# Altium schematic sheet SimonDuino.SchDoc
size A2; SheetNumber: 1; SheetTotal: 1
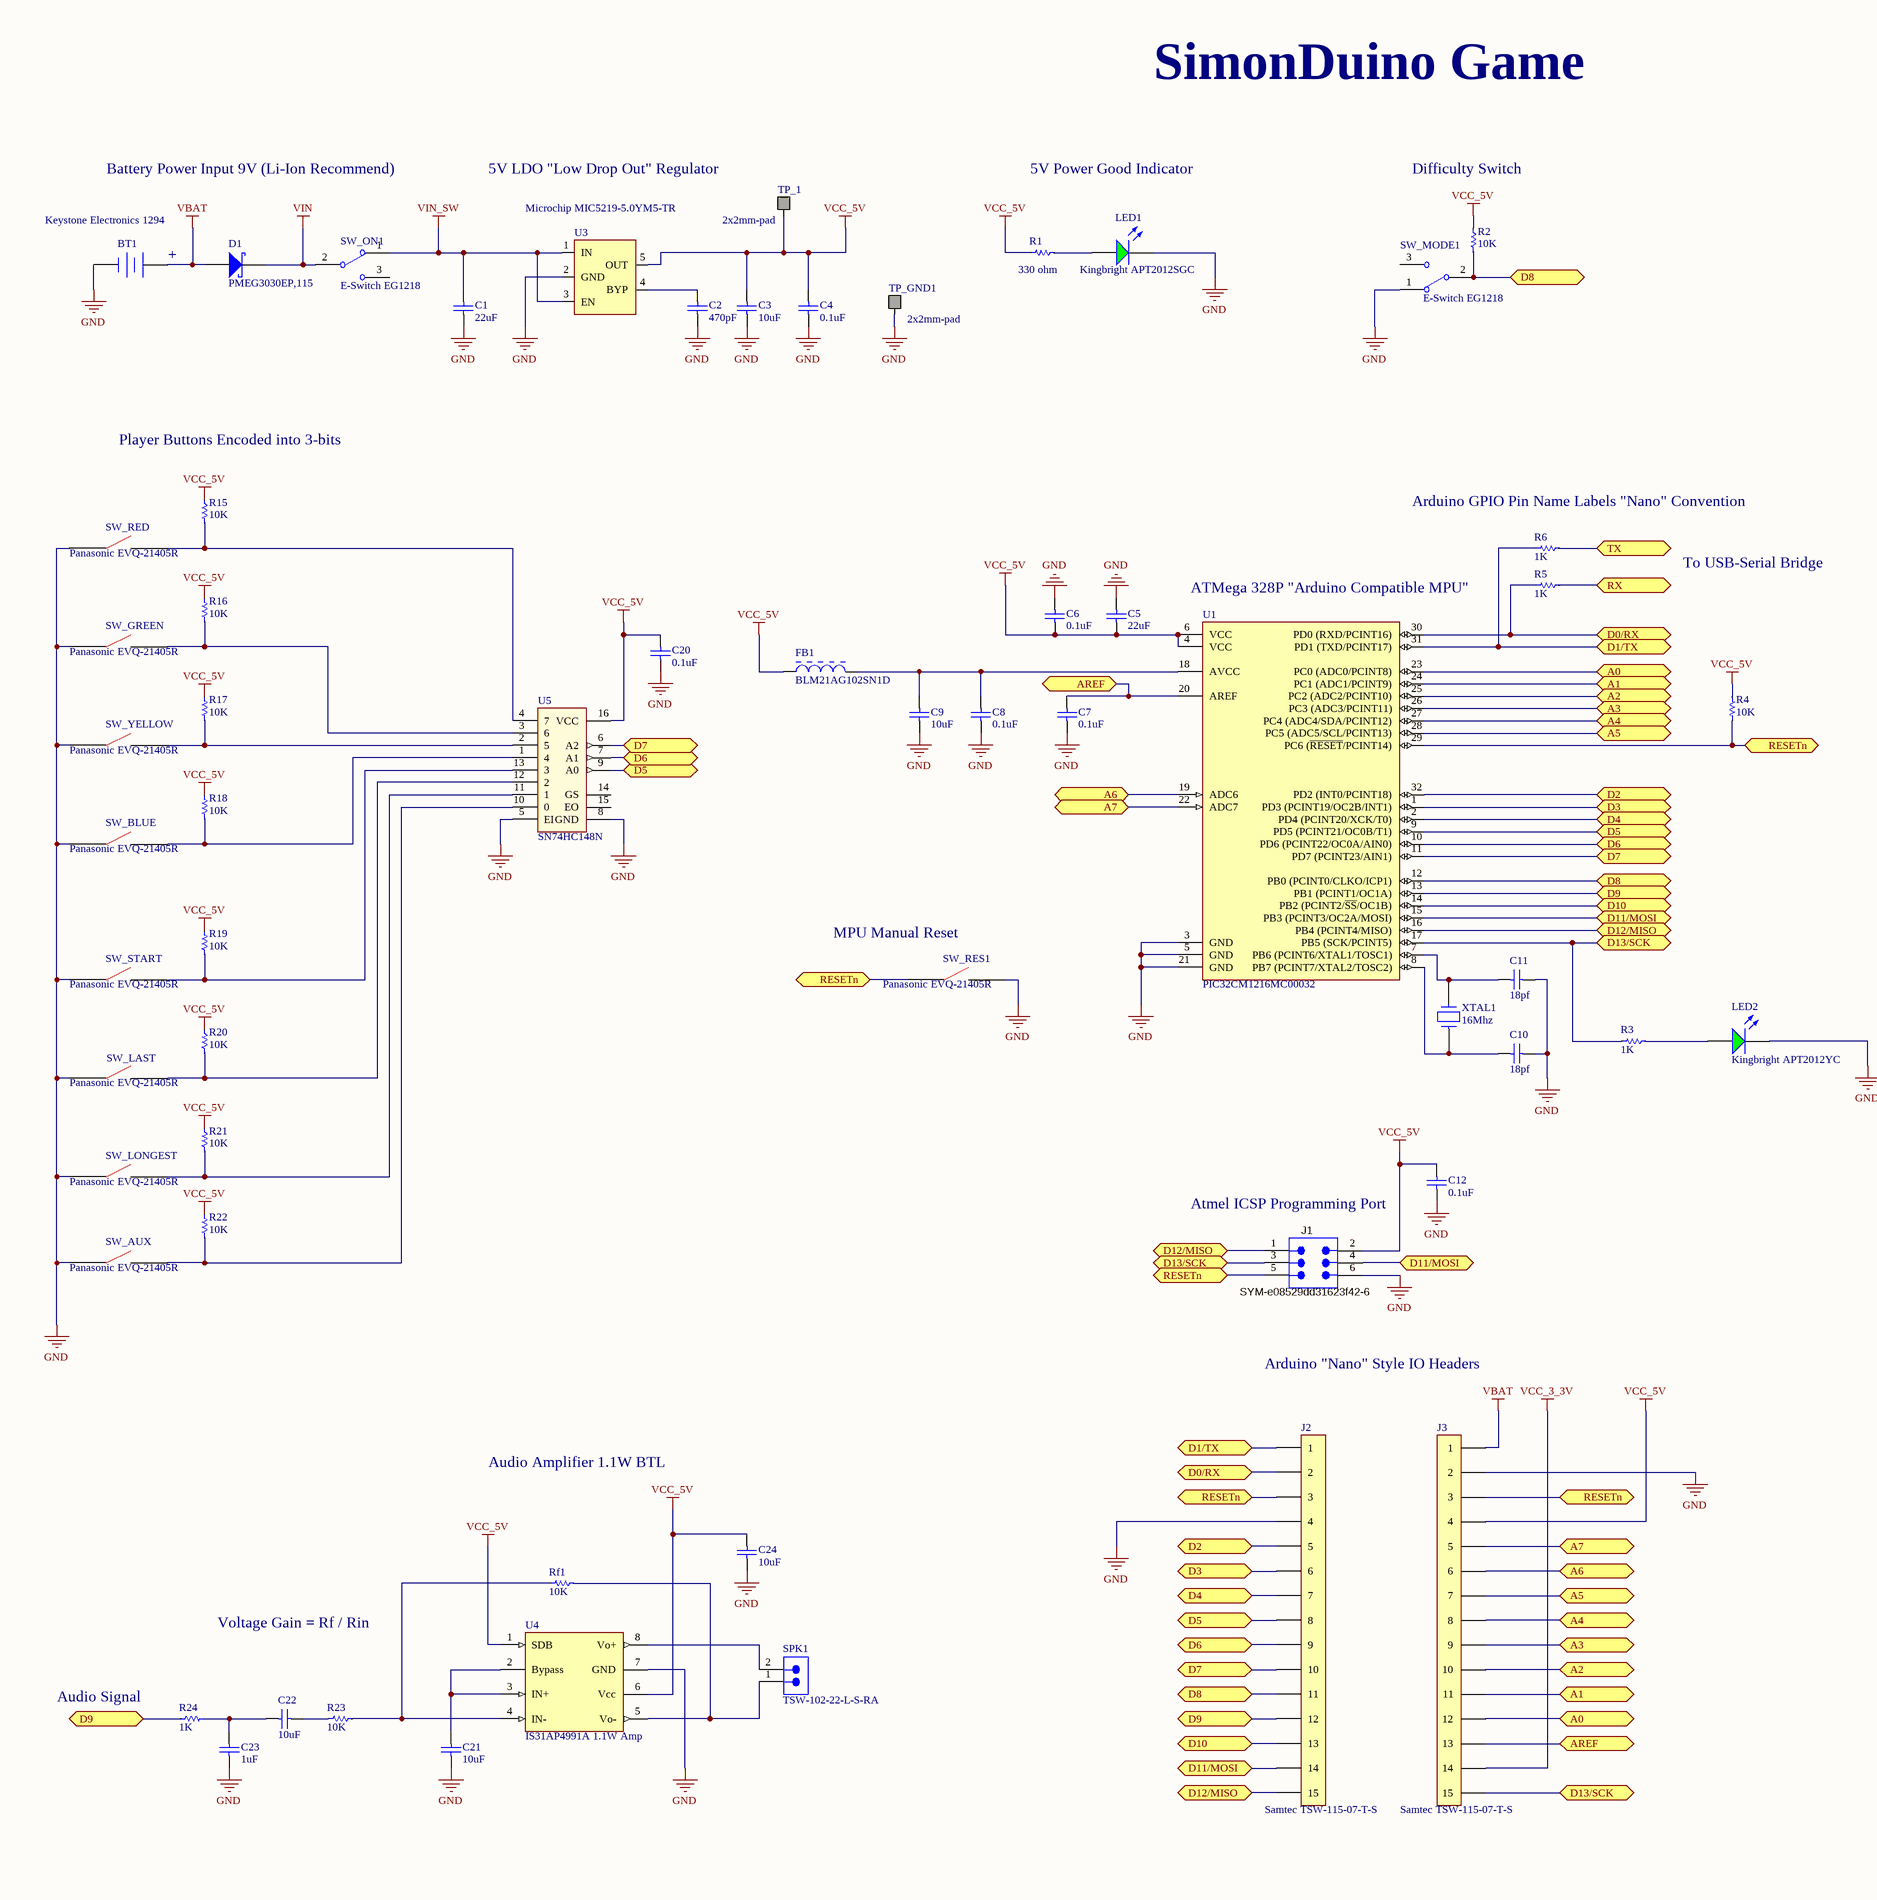
[diagram p0: SimonDuino.SchDoc, left]
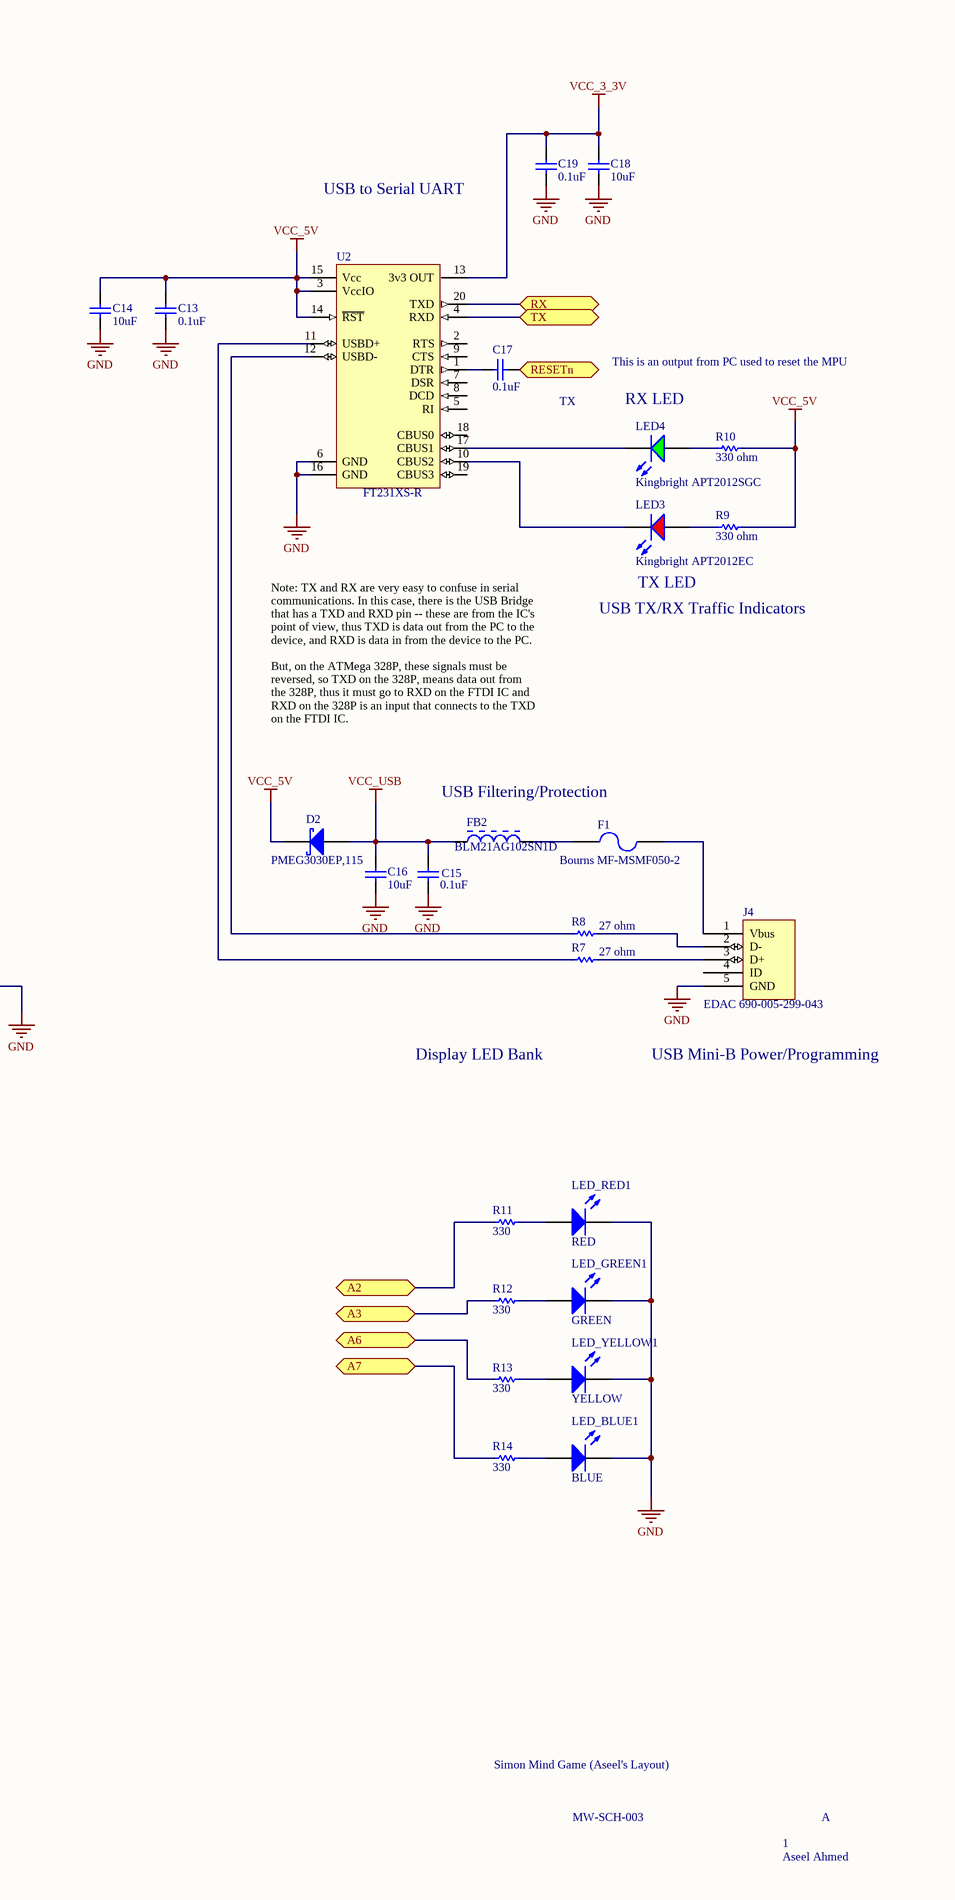
[diagram p1: SimonDuino.SchDoc, right]

## Parts
BT1  Keystone Electronics 1294  [PCB-3798-1]
C1  22uF  [RLP133A]
C2  470pF  [RLP133A]
C3  10uF  [RLP133A]
C4  0.1uF  [RLP133A]
C5  22uF  [RLP133A]
C6  0.1uF  [RLP133A]
C7  0.1uF  [RLP133A]
C8  0.1uF  [RLP133A]
C9  10uF  [RLP133A]
C10  18pf  [RLP133A]
C11  18pf  [RLP133A]
C12  0.1uF  [RLP133A]
C13  0.1uF  [RLP133A]
C14  10uF  [RLP133A]
C15  0.1uF  [RLP133A]
C16  10uF  [RLP133A]
C17  0.1uF  [RLP133A]
C18  10uF  [RLP133A]
C19  0.1uF  [RLP133A]
C20  0.1uF  [RLP133A]
C21  10uF  [RLP133A]
C22  10uF  [RLP133A]
C23  1uF  [RLP133A]
C24  10uF  [RLP133A]
D1  PMEG3030EP,115  [PCB-ylvpw7uho1dkst7hexks-1]
D2  PMEG3030EP,115  [PCB-ylvpw7uho1dkst7hexks-1]
F1  Bourns MF-MSMF050-2  [L1812]
FB1  BLM21AG102SN1D  [MURA-BLM21-H1-CHIP-2_V]
FB2  BLM21AG102SN1D  [MURA-BLM21-H1-CHIP-2_V]
J1  SYM-e08529dd31623f42-6  [PCB-2h1t0rpz2tx2wsc79kkt-1]
J2  Samtec TSW-115-07-T-S  [PCB-ss9uik38su1ryg1jck95-1]
J3  Samtec TSW-115-07-T-S  [PCB-ss9uik38su1ryg1jck95-1]
J4  EDAC 690-005-299-043  [PCB-0dqtvzwtjwndkeioqta0-1]
LED1  Kingbright APT2012SGC  [CHIPLED_0805_NOOUTLINE]
LED2  Kingbright APT2012YC  [CHIPLED_0805_NOOUTLINE]
LED3  Kingbright APT2012EC  [CHIPLED_0805_NOOUTLINE]
LED4  Kingbright APT2012SGC  [CHIPLED_0805_NOOUTLINE]
LED_BLUE1  BLUE  [PCB-teu6t62n2bsx7jl1if62-1]
LED_GREEN1  GREEN  [PCB-teu6t62n2bsx7jl1if62-1]
LED_RED1  RED  [PCB-teu6t62n2bsx7jl1if62-1]
LED_YELLOW1  YELLOW  [PCB-teu6t62n2bsx7jl1if62-1]
R1  330 ohm  [RESC2013X70X40LL20T20]
R2  10K  [RESC2013X70X40LL20T20]
R3  1K  [RESC2013X70X40LL20T20]
R4  10K  [RESC2013X70X40LL20T20]
R5  1K  [RESC2013X70X40LL20T20]
R6  1K  [RESC2013X70X40LL20T20]
R7  27 ohm  [RESC2013X70X40LL20T20]
R8  27 ohm  [RESC2013X70X40LL20T20]
R9  330 ohm  [RESC2013X70X40LL20T20]
R10  330 ohm  [RESC2013X70X40LL20T20]
R11  330  [RESC2013X70X40LL20T20]
R12  330  [RESC2013X70X40LL20T20]
R13  330  [RESC2013X70X40LL20T20]
R14  330  [RESC2013X70X40LL20T20]
R15  10K  [RESC2013X70X40LL20T20]
R16  10K  [RESC2013X70X40LL20T20]
R17  10K  [RESC2013X70X40LL20T20]
R18  10K  [RESC2013X70X40LL20T20]
R19  10K  [RESC2013X70X40LL20T20]
R20  10K  [RESC2013X70X40LL20T20]
R21  10K  [RESC2013X70X40LL20T20]
R22  10K  [RESC2013X70X40LL20T20]
R23  10K  [RESC2013X70X40LL20T20]
R24  1K  [RESC2013X70X40LL20T20]
Rf1  10K  [RESC2013X70X40LL20T20]
SPK1  TSW-102-22-L-S-RA  [SMTC-TSW-102-22-X-S-RA]
SW_AUX  Panasonic EVQ-21405R  [PCB-je10m8m3eogq13l465bo-1]
SW_BLUE  Panasonic EVQ-21405R  [PCB-je10m8m3eogq13l465bo-1]
SW_GREEN  Panasonic EVQ-21405R  [PCB-je10m8m3eogq13l465bo-1]
SW_LAST  Panasonic EVQ-21405R  [PCB-je10m8m3eogq13l465bo-1]
SW_LONGEST  Panasonic EVQ-21405R  [PCB-je10m8m3eogq13l465bo-1]
SW_MODE1  E-Switch EG1218  [ESWI-EG1218_V]
SW_ON1  E-Switch EG1218  [ESWI-EG1218_V]
SW_RED  Panasonic EVQ-21405R  [PCB-je10m8m3eogq13l465bo-1]
SW_RES1  Panasonic EVQ-21405R  [PCB-je10m8m3eogq13l465bo-1]
SW_START  Panasonic EVQ-21405R  [PCB-je10m8m3eogq13l465bo-1]
SW_YELLOW  Panasonic EVQ-21405R  [PCB-je10m8m3eogq13l465bo-1]
TP_1  2x2mm-pad  [PCB-iek5qk9ganu4yn12lo6h-1]
TP_GND1  2x2mm-pad  [PCB-iek5qk9ganu4yn12lo6h-1]
U1  PIC32CM1216MC00032  [Quad32]
U2  FT231XS-R  [SSOP20_L]
U3  Microchip MIC5219-5.0YM5-TR  [PCB-wkjlo8hhy83bmub82728-1]
U4  IS31AP4991A 1.1W Amp  [PCB-9rmbxp4o58shl47xlmib-1]
U5  SN74HC148N  [PCB-humlfp2qb5uk19pmpc47-1]
XTAL1  16Mhz  [PCB-tw4o7k9ciwtd4bkcirmp-1]

## Ports
A0 (bidir), A1 (bidir), A2 (bidir), A3 (bidir), A4 (bidir), A5 (bidir), A6 (bidir), A7 (bidir), AREF (bidir), D0/RX (bidir), D1/TX (bidir), D2 (bidir), D3 (bidir), D4 (bidir), D5 (bidir), D6 (bidir), D7 (bidir), D8 (bidir), D9 (bidir), D10 (bidir), D11/MOSI (bidir), D12/MISO (bidir), D13/SCK (bidir), RESETn (bidir), RX (bidir), TX (bidir)

## Nets
GND: BT1.2(-) C1.1 C2.1 C3.1 C4.1 C5.1 C6.1 C7.2 C8.1 C9.1 C10.1 C11.1 C12.2 C13.1 C14.1 C15.1 C16.1 C18.1 C19.1 C20.1 C21.1 C23.2 C24.1 J1.6 J2.4 J3.2 J4.5(GND) LED1.C LED2.C LED_BLUE1.1(K) LED_GREEN1.1(K) LED_RED1.1(K) LED_YELLOW1.1(K) SW_AUX.1 SW_BLUE.1 SW_GREEN.1 SW_LAST.1 SW_LONGEST.1 SW_MODE1.1 SW_RED.1 SW_RES1.2 SW_START.1 SW_YELLOW.1 TP_GND1.1 U1.3(GND) U1.5(GND) U1.21(GND) U2.6(GND) U2.16(GND) U3.2(GND) U4.7(GND) U5.5(EI) U5.8(GND)
VBAT: BT1.1(+) D1.1(A) J3.1
VCC_3_3V: C18.2 C19.2 J3.14 U2.13(3v3_OUT)
VCC_5V: C3.2 C4.2 C5.2 C6.2 C12.1 C13.2 C14.2 C20.2 C24.2 D2.2(K) FB1.1 J1.2 J3.4 R1.1 R2.1 R4.2 R9.1 R10.1 R15.1 R16.1 R17.1 R18.1 R19.1 R20.1 R21.1 R22.1 TP_1.1 U1.4(VCC) U1.6(VCC) U2.3(VccIO) U2.14(~{RST}) U2.15(Vcc) U3.5(OUT) U4.1(SDB) U4.6(Vcc) U5.16(VCC)
VCC_USB: C15.2 C16.2 D2.1(A) FB2.1
VIN: D1.2(K) SW_ON1.2(COM)
VIN_SW: C1.2 SW_ON1.1 U3.1(IN) U3.3(EN)
A0: J3.12 U1.23(PC0_(ADC0/PCINT8)) ; port A0
A1: J3.11 U1.24(PC1_(ADC1/PCINT9)) ; port A1
A2: J3.10 R11.1 U1.25(PC2_(ADC2/PCINT10)) ; port A2
A3: J3.9 R12.1 U1.26(PC3_(ADC3/PCINT11)) ; port A3
A4: J3.8 U1.27(PC4_(ADC4/SDA/PCINT12)) ; port A4
A5: J3.7 U1.28(PC5_(ADC5/SCL/PCINT13)) ; port A5
A6: J3.6 R13.1 U1.19(ADC6) ; port A6
A7: J3.5 R14.1 U1.22(ADC7) ; port A7
AREF: C7.1 J3.13 U1.20(AREF) ; port AREF
D0/RX: J2.2 R5.1 U1.30(PD0_(RXD/PCINT16)) ; port D0/RX
D1/TX: J2.1 R6.1 U1.31(PD1_(TXD/PCINT17)) ; port D1/TX
D2: J2.5 U1.32(PD2_(INT0/PCINT18)) ; port D2
D3: J2.6 U1.1(PD3_(PCINT19/OC2B/INT1)) ; port D3
D4: J2.7 U1.2(PD4_(PCINT20/XCK/T0)) ; port D4
D5: J2.8 U1.9(PD5_(PCINT21/OC0B/T1)) U5.9(A0) ; port D5
D6: J2.9 U1.10(PD6_(PCINT22/OC0A/AIN0)) U5.7(A1) ; port D6
D7: J2.10 U1.11(PD7_(PCINT23/AIN1)) U5.6(A2) ; port D7
D8: J2.11 R2.2 SW_MODE1.2(COM) U1.12(PB0_(PCINT0/CLKO/ICP1)) ; port D8
D9: J2.12 R24.2 U1.13(PB1_(PCINT1/OC1A)) ; port D9
D10: J2.13 U1.14(PB2_(PCINT2/~{SS}/OC1B)) ; port D10
D11/MOSI: J1.4 J2.14 U1.15(PB3_(PCINT3/OC2A/MOSI)) ; port D11/MOSI
D12/MISO: J1.1 J2.15 U1.16(PB4_(PCINT4/MISO)) ; port D12/MISO
D13/SCK: J1.3 J3.15 R3.1 U1.17(PB5_(SCK/PCINT5)) ; port D13/SCK
RESETn: C17.1 J1.5 J2.3 J3.3 R4.1 SW_RES1.1 U1.29(PC6_(~{RESET}/PCINT14)) ; port RESETn
RX: R5.2 U2.20(TXD) ; port RX
TX: R6.2 U2.4(RXD) ; port TX
NetC2_2: C2.2 U3.4(BYP)
NetC8_2: C8.2 C9.2 FB1.2 U1.18(AVCC)
NetC10_2: C10.2 U1.8(PB7_(PCINT7/XTAL2/TOSC2)) XTAL1.1
NetC11_2: C11.2 U1.7(PB6_(PCINT6/XTAL1/TOSC1)) XTAL1.2
NetC17_2: C17.2 U2.1(DTR)
NetC21_2: C21.2 U4.2(Bypass) U4.3(IN+)
NetC22_1: C22.1 R23.1
NetC22_2: C22.2 C23.1 R24.1
NetF1_1: F1.1 FB2.2
NetF1_2: F1.2 J4.1(Vbus)
NetJ4_2: J4.2(D-) R8.2
NetJ4_3: J4.3(D+) R7.2
NetLED1_A: LED1.A R1.2
NetLED2_A: LED2.A R3.2
NetLED3_A: LED3.A R9.2
NetLED3_C: LED3.C U2.10(CBUS2)
NetLED4_A: LED4.A R10.2
NetLED4_C: LED4.C U2.17(CBUS1)
NetLED_BLUE1_2: LED_BLUE1.2(A) R14.2
NetLED_GREEN1_2: LED_GREEN1.2(A) R12.2
NetLED_RED1_2: LED_RED1.2(A) R11.2
NetLED_YELLOW1_2: LED_YELLOW1.2(A) R13.2
NetR7_1: R7.1 U2.11(USBD+)
NetR8_1: R8.1 U2.12(USBD-)
NetR15_2: R15.2 SW_RED.2 U5.4(7)
NetR16_2: R16.2 SW_GREEN.2 U5.3(6)
NetR17_2: R17.2 SW_YELLOW.2 U5.2(5)
NetR18_2: R18.2 SW_BLUE.2 U5.1(4)
NetR19_2: R19.2 SW_START.2 U5.13(3)
NetR20_2: R20.2 SW_LAST.2 U5.12(2)
NetR21_2: R21.2 SW_LONGEST.2 U5.11(1)
NetR22_2: R22.2 SW_AUX.2 U5.10(0)
NetR23_2: R23.2 Rf1.1 U4.4(IN-)
NetRf1_2: Rf1.2 SPK1.1 U4.5(Vo-)
NetSPK1_2: SPK1.2 U4.8(Vo+)

Not connected (* = marked no-connect by the designer): J4 4(ID); SW_MODE1 3; SW_ON1 3; U2 2(RTS) 5(RI) 7(DSR) 8(DCD) 9(CTS) 18(CBUS0) 19(CBUS3); U5 14(GS) 15(EO)

## Notes on the sheet
- SimonDuino Game
- Battery Power Input 9V (Li-Ion Recommend)
- 5V LDO "Low Drop Out" Regulator
- 5V Power Good Indicator
- Difficulty Switch
- (near BT1) +
- USB to Serial UART
- Player Buttons Encoded into 3-bits
- (near R6) Arduino GPIO Pin Name Labels "Nano" Convention
- TX
- This is an output from PC used to reset the MPU
- RX LED
- To USB-Serial Bridge
- (near U1) ATMega 328P "Arduino Compatible MPU"
- USB TX/RX Traffic Indicators
- TX LED
- Note: TX and RX are very easy to confuse in serial
  communications. In this case, there is the USB Bridge
  that has a TXD and RXD pin -- these are from the IC's
  point of view, thus TXD is data out from the PC to the
  device, and RXD is data in from the device to the PC.
  But, on the ATMega 328P, these signals must be
  reversed, so TXD on the 328P, means data out from
  the 328P, thus it must go to RXD on the FTDI IC and
  RXD on the 328P is an input that connects to the TXD
  on the FTDI IC.
- USB Filtering/Protection
- (near SW_RES1) MPU Manual Reset
- Display LED Bank
- USB Mini-B Power/Programming
- Atmel ICSP Programming Port
- Arduino "Nano" Style IO Headers
- Audio Amplifier 1.1W BTL
- Voltage Gain = Rf / Rin
- (near R24) Audio Signal
- Simon Mind Game (Aseel's Layout)
- MW-SCH-003
- 1
- Aseel Ahmed
- A

## Library data of the parts
BT1 = 1294: HOLDER BATT 9V UNIV PLASTIC PC; Lead-Free Status: Lead Free; Number of Contacts: 2; Octopart Url: https://octopart.com/1294-keystone-3743; Material: Plastic; REACH SVHC Compliance: No SVHC; Contact Plating: Nickel; RoHS: Compliant; Packaging: Bulk; OctopartID: fd44344ed6bd2283; Contact Material: Steel
C1 C3-C24 = 08055C104KAT2A: Generic Multilayer Ceramic Capacitor SMD 0805 (2012); Voltage Rating (DC): 50.0 V; Capacitance: 100 nF; Insulation Resistance: 100 GΩ; Lead-Free Status: Lead Free; Packaging: Cut Tape (CT), Tape & Reel (TR); Mounting Style: Surface Mount; Number of Pins: 2; Size-Length: 2.01 mm
C2 = CMP-3c98f6df3913e35f-11: Generic Multilayer Ceramic Capacitor SMD 0805 (2012); Voltage Rating (DC): 50.0 V; Capacitance: 100 nF; Insulation Resistance: 100 GΩ; Lead-Free Status: Lead Free; Packaging: Cut Tape (CT), Tape & Reel (TR); Mounting Style: Surface Mount; Number of Pins: 2; Size-Length: 2.01 mm
D1 D2 = PMEG3030EP,115: PMEG3030EP 3 A 30 Vrrm SMT MEGA Schottky Barrier Rectifier - SOD-128F; Lead-Free Status: Lead Free; RoHS: Compliant; OctopartID: 93505b4aaf424c97; Octopart URL: http://octopart.com/pmeg3030ep%2C115-nxp+semiconductors-17832308; Mounting Style: Surface Mount; Lifecycle Status: Active
F1 = MF-MSMF050-2: PTC RESETTABLE .50A 15V 1812; Lead-Free Status: Lead Free; Power Dissipation: 0.8 W; Resistance: 0.15 Ω; Holding Current: 0.5 A; Voltage Rating (DC): 15.0 V; Case/Package (SI): 4532; Tripping Current: 1.0 A; Current Rating: 100.0 A; Case/Package: 1812; REACH SVHC Compliance: No SVHC; Size-Length: 0.00455 m; Size-Height: 0.00085 m; RoHS: Compliant; Mounting Style: Surface Mount; Size-Width: 0.00341 m; OctopartID: 9a15531fd2fc45d2; Operating Voltage: 15.0 V; Octopart Url: https://octopart.com/mf-msmf050-2-bourns-28047
FB1 FB2 = BLM21AG102SN1D: Chip Ferrite Bead for General Signal lines, 1000 Ohm, 500 mA, -55 to 125 degC, 2 x 1.25 x 1.05 mm SMD, Tape and Reel; Case/Package (SI): 2012; Current Rating: 0.2 A; Frequency: 100000000.0 Hz; Lead-Free Status: Lead Free; Number of Circuits: 1; Resistance: 1000.0 Ω; Shielding: No; Case/Package: 0805; Mounting Style: Surface Mount; Number of Pins: 2; Octopart Url: https://octopart.com/blm21ag102sn1d-murata-368343; OctopartID: 58c391cce3728704; REACH SVHC Compliance: No SVHC; RoHS: Compliant; Size-Height: 0.00085 m; Size-Length: 0.002 m; Size-Width: 0.00125 m
J1 = M20-9980346: 2.54mm (0.1") Pitch DIL Vertical PC Tail Pin Header, 6.1mm mating pin height, tin, 3+3 contacts; Number of Contacts: 6; Contact Plating: Tin; Manufacturer Part Number: M20-9980346; Contact Material: Phosphor Bronze; OctopartID: e08529dd31623f42
J2 J3 = TSW-115-07-T-S: Conn Unshrouded Header HDR 15 POS 2.54mm Solder ST Thru-Hole Automotive Bulk
J4 = CMP-f10139da97e32ec6-2: 5 Pin Right Angle Surface Mount Mini USB Type B
LED1 LED4 = APT2012SGC: LED 2X1.2MM 568NM GN WTR CLR SMD; Case/Package (SI): 2012; Color: Green; Lead-Free Status: Lead Free; Luminous Intensity: 0.015 cd; Viewing Angle: 120 °; Wavelength: 5.68e-07 m; Case/Package: 0805; Octopart Url: https://octopart.com/apt2012sgc-kingbright-868583; OctopartID: 33bcfabb563dec7b; Packaging: Reel; RoHS: Compliant
LED2 = CMP-1546221-2: LED 2X1.2MM 568NM GN WTR CLR SMD; Case/Package (SI): 2012; Color: Yellow; Lead-Free Status: Lead Free; Luminous Intensity: 0.015 cd; Viewing Angle: 120 °; Wavelength: 5.68e-07 m; Case/Package: 0805; Octopart Url: https://octopart.com/apt2012sgc-kingbright-868583; OctopartID: 33bcfabb563dec7b; Packaging: Reel; RoHS: Compliant
LED3 = APT2012EC: LED 2X1.2MM 625NM RD WTR CLR SMD; Case/Package (SI): 2012; Color: Red; Lead-Free Status: Lead Free; Luminous Intensity: 0.012 cd; Viewing Angle: 120 °; Wavelength: 6.25e-07 m; Case/Package: 0805; Octopart Url: https://octopart.com/apt2012ec-kingbright-868855; OctopartID: 365fff5852cee998; Packaging: Reel; RoHS: Compliant
LED_BLUE1 LED_GREEN1 LED_RED1 LED_YELLOW1 = CMP-92bb5b2eff764d7c-3: LED Uni-Color Green 2-Pin T-1 3/4 Bulk; Manufacturer Part Number: C503B-GCN-CY0C0791; Manufacturer: Cree; Viewing Angle: 30 °; Luminous Intensity: 12.5 cd; Wavelength: 527 nm; Forward Voltage: 3.20 V; RoHS: Compliant; Mounting Style: Through Hole; Octopart URL: http://octopart.com/c503b-gcn-cy0c0791-cree-10438827; Color: Green; OctopartID: 92bb5b2eff764d7c; Number of Pins: 2
R1-R24 Rf1 = ERJ-6ENF1001V: @ RESISTOR,SMT,0805,1K OHM, +/-1%,+-100ppm,THICKFILM(100); Voltage Rating (DC): 150.0 V; Resistance Tolerance: ±1%; Case/Package (SI): 2012; Lead-Free Status: Lead Free; Resistance: 1000.0 Ω; Power Rating: 0.125 W; Mounting Style: Surface Mount; OctopartID: 00a1cae6889bdf66; Number of Pins: 2; Lifecycle Status: Not Listed by Manufacturer; Size-Length: 0.002 m; Octopart Url: https://octopart.com/erj-6enf1001v-panasonic-55422300; Case/Package: 0805; RoHS: Compliant; Size-Height: 0.0006 m; Size-Width: 0.00125 m; REACH SVHC Compliance: No SVHC
SPK1 = TSW-102-22-L-S-RA: 0.025" SQ Post Header, Through-hole, Right Angle, -55 to 125 degC, 2.54 mm Pitch, 2-Pin, Male, RoHS; Number of Contacts: 2; Pin Pitch: 0.00254 m; Contact Material: Phosphor Bronze; Contact Plating: Gold; Gender: Male; Mounting Style: Through Hole; Number of Rows: 1; Octopart Url: https://octopart.com/tsw-102-22-l-s-ra-samtec-11758137; OctopartID: 0b86c23f44d9d441; REACH SVHC Compliance: No SVHC; RoHS: Compliant
SW_AUX SW_BLUE SW_GREEN SW_LAST SW_LONGEST SW_RED SW_RES1 SW_START SW_YELLOW = CMP-2fe5e5be239cf022-2: Switch Tactile N.O. SPST Round Button PC Pins 0.02A 15VDC 1.3N Thru-Hole Radial T/R; Contact Current Rating: 20.0 mA; Contacts Type: SPST-NO; Actuator Type: Standard; Lead-Free Status: Lead Free; OctopartID: 2fe5e5be239cf022; Element14 Part No.: 2281982; Size-Width: 6.00 mm; Element14 Min Order: 1; Packaging: Tape & Reel (TR); Lifecycle Status: Not Listed by Manufacturer; Element14 Price Per: $0.109; Mounting Style: Through Hole, PC Board; Size-Length: 6.00 mm; Orientation: Vertical; Element14 URL: http://au.element14.com/panasonic-electronic-components/evq-21405r/switch-tactile-spst-no-20ma-15vdc/dp/2281982; Octopart URL: http://octopart.com/evq-21405r-panasonic-55650591; Manufacturer Part Number: EVQ-21405R; RoHS: Compliant
SW_MODE1 SW_ON1 = CMP-9a5a5340a2f5459d-7: Slide Switch, 500 V, -20 to 70 degC, 3-Pin THD, RoHS; Current Rating: 200 mA; Contacts Type: SPDT; Actuator Type: Standard; Number of Positions: 2; Lead-Free Status: Lead Free; OctopartID: 9a5a5340a2f5459d; PackageDescription: 3-Pin Through Hole Device, Body 11.6 x 4 mm, Pitch 2.5 mm; Orientation: Vertical; Mounting Style: PCB, Through Hole; DatasheetVersion: Oct-15; Size-Height: 5.40 mm; Manufacturer Part Number: EG1218; Contact Plating: Silver; Seller Landing  Url: https://octopart-clicks.com/click/track?country=US&ak=8157f166&sig=0e9adab&sid=459&ppid=1056201&vpid=1179261&ct=offers; Size-Length: 2.03 mm; Octopart Url: http://octopart.com/eg1218-e-switch-1056201; Contact Material: Copper Alloy; Size-Width: 4.00 mm; Packaging: Bulk; PackageReference: EG1218; RoHS: Compliant
TP_1 TP_GND1 = RCT-0C: Raychem; SMT Circuit probe pad, 0805, 0R0 RCT
U1 = CMP-1210585-13: 5V Cortex ARM M0+ with 128K Flash and 16K RAM
U2 = CMP-1315745-6: USB Full Speed to Full Handshake UART with USB Charger Detection; Manufacturer: Future Technologies; Packaging: Tape; Seller Landing  Url: https://octopart-clicks.com/click/track?country=US&ak=8157f166&sig=0ac6205&sid=459&ppid=22061507&vpid=46595747&ct=offers; Mounting Style: Surface Mount; Octopart Url: http://octopart.com/ft231xs-r-ftdi-22061507; Manufacturer Part Number: FT231XS-R; OctopartID: 526a9a30d6cf8dad; RoHS: Compliant
U3 = CMP-8be04111fcdb5427-1: MIC5219 Series 500 mA 5 V Fixed Output Surface Mount LDO Regulator - SOT-23-5; Input Voltage (DC): 12.0 V (max); Lead-Free Status: Lead Free; Output Current: 500 mA; Packaging: Tape, Tape & Reel (TR); Manufacturer Part Number: MIC5219-5.0YM5-TR; Lifecycle Status: Not Listed by Manufacturer; Mounting Style: Surface Mount; Octopart URL: http://octopart.com/mic5219-5.0ym5-tr-microchip-66802269; REACH SVHC Compliance: No SVHC; Case/Package: SOT-23; RoHS: Compliant; Number of Pins: 5; OctopartID: 8be04111fcdb5427
U4 = IS31AP4991A-GRLS2-TR: Audio Amp Speaker 1-CH Mono 1.4W Class-AB 8-Pin SOP T/R; Octopart URL: http://octopart.com/is31ap4991a-grls2-tr-issi-34842321
U5 = SN74HC148N: 8-Line To 3-Line Priority Encoders 16-SOIC -40 to 85; Supply Voltage (DC): V; Supply Current: 0.0001 A; Number of Circuits: 1; Voltage Nodes: 6.0, 5.0, 2.0 V; Output Current Drive: -0.001 A; Number of Outputs: 5; OctopartID: 21e6e8edbd0afe21; Manufacturer Part Number: SN74HC148N; REACH SVHC Compliance: No SVHC; Mounting Style: Surface Mount; Packaging: Tube; RoHS: Compliant; Octopart URL: http://octopart.com/sn74hc148n-texas+instruments-113034
XTAL1 = 9B-16.000MEEJ-B: Crystal 16.0000 MHz; Frequency: 16.0 MHz; Load Capacitance: 18.0 pF; RoHS: Compliant; Manufacturer Part Number: 9B-16.000MEEJ-B; Number of Pins: 2; Octopart URL: http://octopart.com/9b-16.000meej-b-txc-18803041